# EAGLE schematic gm328a (EAGLE 7.2.0)
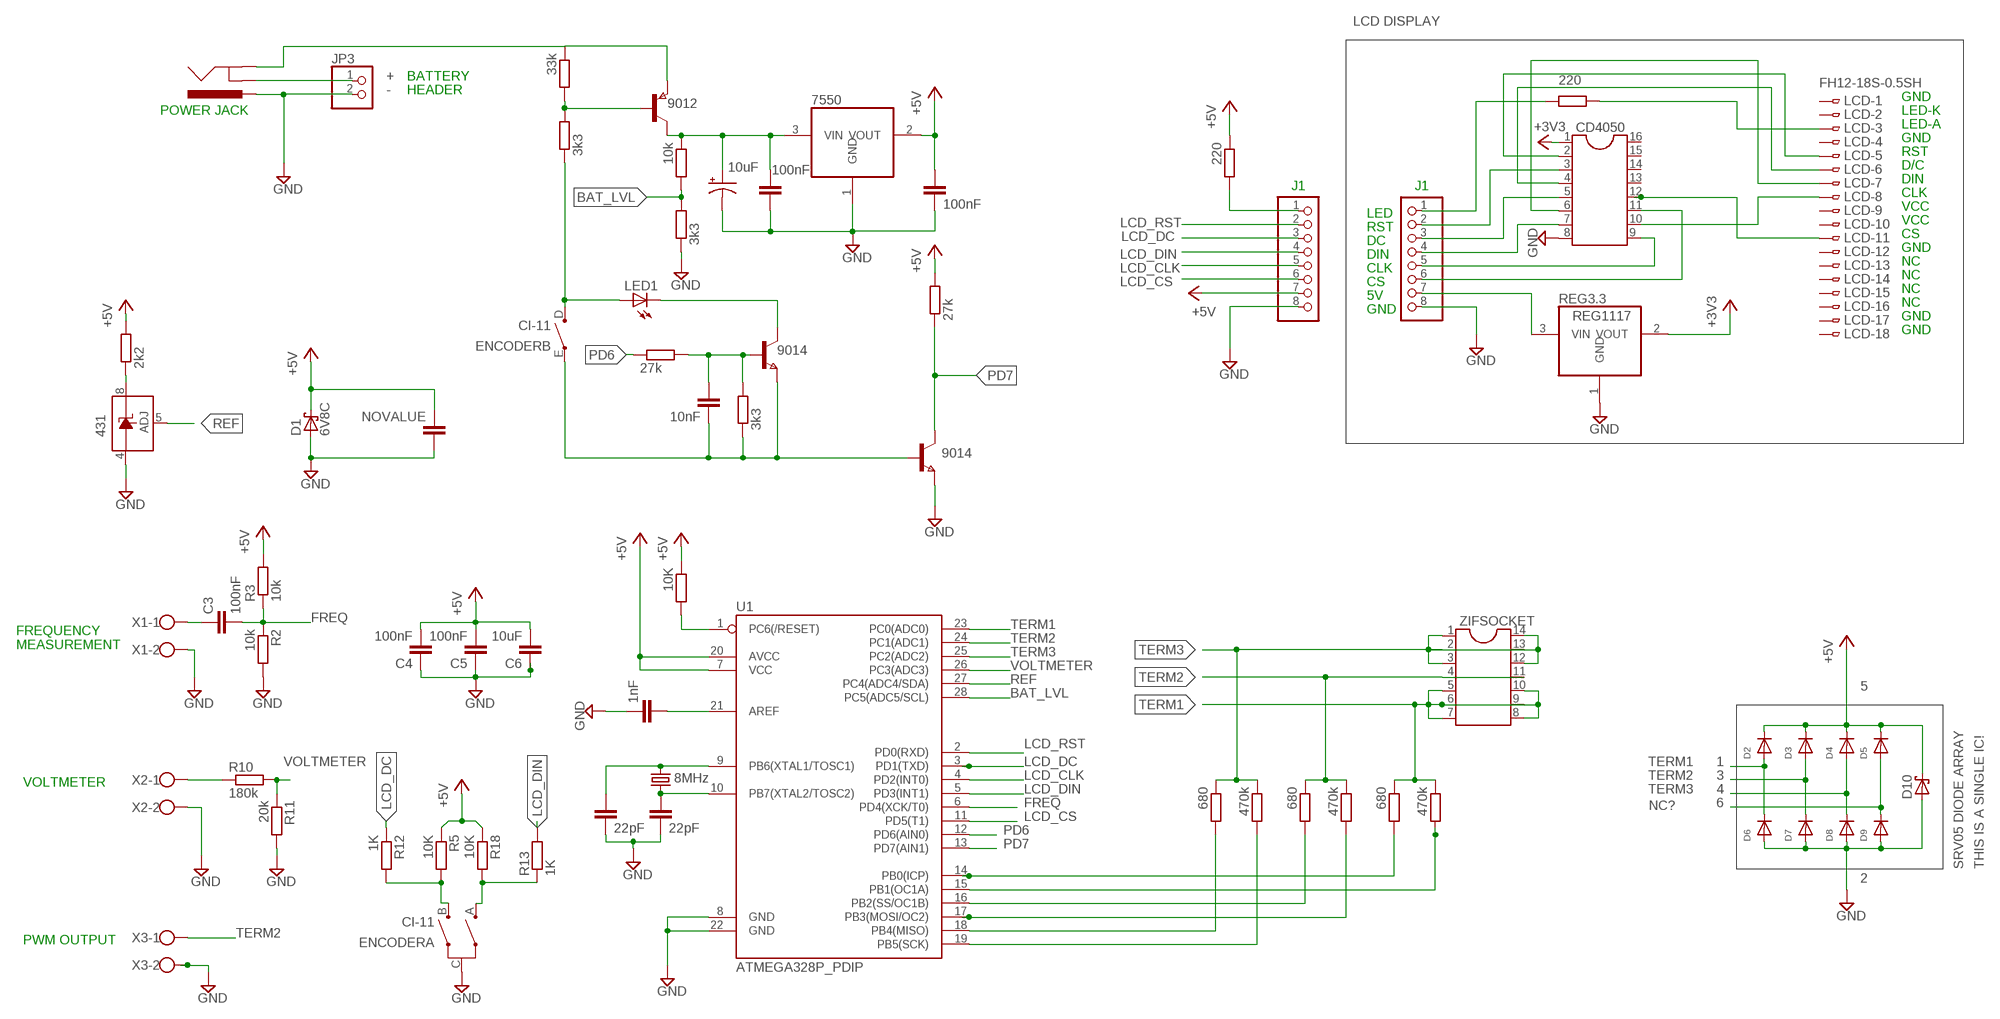
[diagram p0: schematic, sheet 1]

## Parts
1  9014  NPNSOT323  [SOT323]
10K6  10K  R-EU_M0805  [M0805]
7550  REG1117  [SOT223]
9012  PNPSOT323  [SOT323]
9014  NPNSOT323  [SOT323]
C1  22pF  C-EUC0805  [C0805]
C2  22pF  C-EUC0805  [C0805]
C3  100nF  C-EUC0805  [C0805]
C4  100nF  C-EUC0805  [C0805]
C5  100nF  C-EUC0805  [C0805]
C6  10uF  C-EUC0805  [C0805]
C7  100nF  C-EUC0805  [C0805]
C8  10uF  CPOL-USC  [PANASONIC_C]
C9  100nF  C-EUC0805  [C0805]
C10  10nF  C-EUC0805  [C0805]
C11  1nF  C-EUC0805  [C0805]
C12  NOVALUE  C-EUC0805  [C0805]
CD4050  DIL16  [DIL16]
D1  6V8C  P4KEXX  [DO41-10]
D2  DIODE_SOD-123FL  [SOD-123FL]
D3  DIODE_SOD-123FL  [SOD-123FL]
D4  DIODE_SOD-123FL  [SOD-123FL]
D5  DIODE_SOD-123FL  [SOD-123FL]
D6  DIODE_SOD-123FL  [SOD-123FL]
D7  DIODE_SOD-123FL  [SOD-123FL]
D8  DIODE_SOD-123FL  [SOD-123FL]
D9  DIODE_SOD-123FL  [SOD-123FL]
D10  P4KEXX  [DO41-10]
ENCODER  CI-11  [CI-11]
IC1  LM336D  [SO08]
J1  POWER_JACKSLT  [POWER_JACK_SLOT]
JP1  PINHD-1X8  [1X08]
JP2  PINHD-1X8  [1X08]
JP3  PINHD-1X2  [1X02]
LCD  FH12-18S-0.5SH  [FH12-18S-0.5SH]
LED1  LEDSML0805  [SML0805]
Q1  8MHz  CRYSTALHC49S  [HC49/S]
R1  220  R-EU_M0805  [M0805]
R2  10k  R-EU_M0805  [M0805]
R3  10k  R-EU_M0805  [M0805]
R4  220  R-EU_M0805  [M0805]
R5  10K  R-EU_M0805  [M0805]
R6  33k  R-EU_M0805  [M0805]
R7  3k3  R-EU_M0805  [M0805]
R8  3k3  R-EU_M0805  [M0805]
R9  10k  R-EU_M0805  [M0805]
R10  180k  R-EU_M0805  [M0805]
R11  20k  R-EU_M0805  [M0805]
R12  1K  R-EU_M0805  [M0805]
R13  1K  R-EU_M0805  [M0805]
R14  2k2  R-EU_M0805  [M0805]
R15  27k  R-EU_M0805  [M0805]
R16  3k3  R-EU_M0805  [M0805]
R17  27k  R-EU_M0805  [M0805]
R18  10K  R-EU_M0805  [M0805]
R19  680  R-EU_M0805  [M0805]
R20  470k  R-EU_M0805  [M0805]
R21  680  R-EU_M0805  [M0805]
R22  470k  R-EU_M0805  [M0805]
R23  680  R-EU_M0805  [M0805]
R24  470k  R-EU_M0805  [M0805]
REG3.3  REG1117  [SOT223]
U1  ATMEGA328P_PDIP  [DIL28-3]
X1  W237-102  [W237-102]
X2  W237-102  [W237-102]
X3  W237-102  [W237-102]
ZIFSOCKET  DIL14S  [SOCKET-14]

## Nets
+3V3: CD4050.1 REG3.3.2(VOUT)
+5V: 10K6.1 7550.2(VOUT) C4.2 C5.2 C6.2 C9.1 C12.2 D1.C D2.C D3.C D4.C D5.C D10.C JP1.7 R3.2 R4.1 R5.1 R14.2 R17.2 R18.1 U1.7(VCC) U1.20(AVCC)
BAT_LVL: R8.2 R9.2 U1.28(PC5(ADC5/SCL))
FREQ: C3.2 R2.1 R3.1 U1.6(PD4(XCK/T0))
GND: 7550.1(GND) 9014.3(E) C1.2 C2.2 C4.1 C5.1 C6.1 C7.2 C8.- C9.2 C11.1 C12.1 CD4050.8 D1.A D6.A D7.A D8.A D9.A D10.A ENCODER.C(A:C) IC1.4(A) J1.PWR JP1.8 JP2.8 JP3.2 R2.2 R8.1 R11.2 REG3.3.1(GND) U1.8(GND) U1.22(GND) X1.2 X2.2 X3.2
LCD_CLK: JP1.5 U1.4(PD2(INT0))
LCD_CS: JP1.6 U1.11(PD5(T1))
LCD_DC: JP1.3 R12.1 U1.3(PD1(TXD))
LCD_DIN: JP1.4 R13.2 U1.5(PD3(INT1))
LCD_RST: JP1.2 U1.2(PD0(RXD))
N$1: JP2.7 REG3.3.3(VIN)
N$2: JP2.1 R1.1
N$3: LCD.3 R1.2
N$4: CD4050.3 JP2.2
N$5: CD4050.5 JP2.3
N$6: CD4050.7 JP2.4
N$7: CD4050.9 JP2.5
N$8: CD4050.11 JP2.6
N$9: CD4050.2 LCD.5
N$10: CD4050.4 LCD.6
N$11: CD4050.6 LCD.7
N$12: C2.1 Q1.2 U1.9(PB6(XTAL1/TOSC1))
N$13: CD4050.10 LCD.8
N$14: CD4050.12 LCD.11
N$15: C1.1 Q1.1 U1.10(PB7(XTAL2/TOSC2))
N$16: C3.1 X1.1
N$17: 1.2(B) C10.2 R15.2 R16.2
N$18: ENCODER.B(A:B) R5.2 R12.2
N$19: ENCODER.A(A:A) R13.1 R18.2
N$20: J1.GND@1(GNDBREAK) JP3.1
N$21: ENCODER.D(B:D) LED1.A R7.1
N$22: JP1.1 R4.2
N$23: 1.3(E) 9014.2(B) C10.1 ENCODER.E(B:E) R16.1
N$24: 9012.2(B) R6.2 R7.2
N$25: 7550.3(VIN) 9012.1(C) C7.1 C8.+ R9.1
N$26: R23.2 U1.14(PB0(ICP))
N$27: R24.2 U1.15(PB1(OC1A))
N$28: 1.1(C) LED1.C
N$29: R21.2 U1.16(PB2(SS/OC1B))
N$30: R22.2 U1.17(PB3(MOSI/OC2))
N$31: R19.2 U1.18(PB4(MISO))
N$32: R20.2 U1.19(PB5(SCK))
N$33: C11.2 U1.21(AREF)
N$34: 10K6.2 U1.1(PC6(/RESET))
N$35: IC1.8(C) R14.1
N$36: R10.1 X2.1
NC?: D5.A D9.C
PD6: R15.1 U1.12(PD6(AIN0))
PD7: 9014.1(C) R17.1 U1.13(PD7(AIN1))
POWER: 9012.3(E) J1.GND@2(GND) R6.1
REF: IC1.5(ADJ) U1.27(PC4(ADC4/SDA))
TERM1: D2.A D6.C R23.1 R24.1 U1.23(PC0(ADC0)) ZIFSOCKET.5 ZIFSOCKET.6 ZIFSOCKET.7 ZIFSOCKET.8 ZIFSOCKET.9 ZIFSOCKET.10
TERM2: D3.A D7.C R21.1 R22.1 U1.24(PC1(ADC1)) X3.1 ZIFSOCKET.4 ZIFSOCKET.11
TERM3: D4.A D8.C R19.1 R20.1 U1.25(PC2(ADC2)) ZIFSOCKET.1 ZIFSOCKET.2 ZIFSOCKET.3 ZIFSOCKET.12 ZIFSOCKET.13 ZIFSOCKET.14
VOLTMETER: R10.2 R11.1 U1.26(PC3(ADC3))
Unconnected: CD4050.13 CD4050.14 CD4050.15 CD4050.16 LCD.1 LCD.2 LCD.4 LCD.9 LCD.10 LCD.12 LCD.13 LCD.14 LCD.15 LCD.16 LCD.17 LCD.18

## Notes on the sheet
- LCD DISPLAY
- + | BATTERY
- - | HEADER
- GND
- POWER JACK | LED-K
- LED-A
- GND
- RST
- D/C
- DIN
- J1 | J1
- CLK
- VCC
- LED
- VCC
- RST
- CS
- DC
- GND
- DIN
- NC
- CLK
- NC
- CS
- NC
- 5V
- NC
- GND
- GND
- GND
- 431
- FREQUENCY 
  MEASUREMENT
- 5
- 1
- 3
- VOLTMETER
- 4
- 6
- SRV05 DIODE ARRAY | THIS IS A SINGLE IC!
- 2
- PWM OUTPUT

## Library data of the parts
1 9014 = zetex:NPNSOT323: NPN TRANSISTOR; MPN: DSS4160U-7; OC_FARNELL: 1710696; OC_NEWARK: 25R4558
10K6 R1-R24 = rcl:R-EU_: RESISTOR, European symbol
7550 REG3.3 = burr-brown:REG1117: 800mA and 1A Low Dropout (LDO) Positive Regulator 1.8V, 2.5V, 2.85V, 3.3V, 5V, and Adj; MPN: REG1117; OC_FARNELL: 1097566; OC_NEWARK: 14P6981
9012 = zetex:PNPSOT323: PNP TRANSISTOR; MPN: 2DB1689-7; OC_FARNELL: 1710698; OC_NEWARK: 25R5667
C1-C7 C9-C12 = rcl:C-EU: CAPACITOR, European symbol
C8 = rcl:CPOL-US: POLARIZED CAPACITOR, American symbol
CD4050 = ic-package:DIL16: Dual In Line / Socket
D1 D10 = diode:P4KEXX: DIODE transient-voltage suppressor
D2-D9 = adafruit:DIODE: Diode SMADIODE - SMA Surface Mount Package 20V 1A Schottky Diode Digikey: 641-1014-6-ND DO-1N4148 - Through Hole Small Current Diode SOD-123 20V 1 A (.5mV Vf) Schottky Diode - Digikey: MBRX120TPMSCT-ND SOD-323 10V 570mA (.38mV Vf, 3ns) Schottky Diode - Digikey: ZLLS410CT-ND SOD-523 30V 30mA Schottky Diode (RB751S-40TE61) - Digikey: RB751S-40TE61CT-ND SOT23-R/W - SOT23 Package (R = Solder Paste/Reflow Ovens, W = Hand-Soldering) BAT54Film 40V 300mA - Digikey: 497-7162-1-ND
ENCODER = piher:CI-11: 11mm Incemental Encoder Source: www.piher.net .. 04-CI-11v04.pdf; OC_FARNELL: unknown; OC_NEWARK: unknown
IC1 = linear:LM336: 2.5-V INTEGRATED REFERENCE CIRCUITS LM236 Source: http://focus.ti.com/lit/ds/symlink/lm336-2.5.pdf
J1 = SparkFun-Connectors:POWER_JACK: Power Jack This is the standard 5.5mm barrel jack for power. The PTH is the most common, proven, reliable, footprint. The Slot footprint only works if the mill layer is transmitted to the PCB fab house so be warned. Mating wall wart : TOL-00298 (and others); PROD_ID: PRT-00119
JP1 JP2 = pinhead:PINHD-1X8: PIN HEADER
JP3 = pinhead:PINHD-1X2: PIN HEADER
LCD = con-hirose:FH12-18S-0.5S: 0.5mm Pitch Connectors For FPC/FFC Source: Data sheet <http://www.hirose.co.jp/cataloge_hp/e58605370.pdf>; MPN: FH12-18S-0.5SH(55); OC_FARNELL: 1324547; OC_NEWARK: 34M6164
LED1 = led:LED: LED OSRAM: - CHIPLED LG R971, LG N971, LY N971, LG Q971, LY Q971, LO R971, LY R971 LH N974, LH R974 LS Q976, LO Q976, LY Q976 LO Q996 - Hyper CHIPLED LW Q18S LB Q993, LB Q99A, LB R99A - SideLED LS A670, LO A670, LY A670, LG A670, LP A670 LB A673, LV A673, LT A673, LW A673 LH A674 LY A675 LS A676, LA A676, LO A676, LY A676, LW A676 LS A679, LY A679, LG A679 - Hyper Micro SIDELED® LS Y876, LA Y876, LO Y876, LY Y876 LT Y87S - SmartLED LW L88C, LW L88S LB L89C, LB L89S, LG L890 LS L89K, LO L89K, LY L89K LS L896, LA L896, LO L896, LY L896 - TOPLED LS T670, LO T670, LY T670, LG T670, LP T670 LSG T670, LSP T670, LSY T670, LOP T670, LYG T670 LG T671, LOG T671, LSG T671 LB T673, LV T673, LT T673, LW T673 LH T674 LS T676, LA T676, LO T676, LY T676, LB T676, LH T676, LSB T676, LW T676 LB T67C, LV T67C, LT T67C, LS T67K, LO T67K, LY T67K, LW E67C LS E67B, LA E67B, LO E67B, LY E67B, LB E67C, LV E67C, LT E67C LW T67C LS T679, LY T679, LG T679 LS T770, LO T770, LY T770, LG T770, LP T770 LB T773, LV T773, LT T773, LW T773 LH T774 LS E675, LA E675, LY E675, LS T675 LS T776, LA T776, LO T776, LY T776, LB T776 LHGB T686 LT T68C, LB T68C - Hyper Mini TOPLED® LB M676 - Mini TOPLED Santana® LG M470 LS M47K, LO M47K, LY M47K Source: http://www.osram.convergy.de LUXEON: - LUMILED® LXK2-PW12-R00, LXK2-PW12-S00, LXK2-PW14-U00, LXK2-PW14-V00 LXK2-PM12-R00, LXK2-PM12-S00, LXK2-PM14-U00 LXK2-PE12-Q00, LXK2-PE12-R00, LXK2-PE12-S00, LXK2-PE14-T00, LXK2-PE14-U00 LXK2-PB12-K00, LXK2-PB12-L00, LXK2-PB12-M00, LXK2-PB14-N00, LXK2-PB14-P00, LXK2-PB14-Q00 LXK2-PR12-L00, LXK2-PR12-M00, LXK2-PR14-Q00, LXK2-PR14-R00 LXK2-PD12-Q00, LXK2-PD12-R00, LXK2-PD12-S00 LXK2-PH12-R00, LXK2-PH12-S00 LXK2-PL12-P00, LXK2-PL12-Q00, LXK2-PL12-R00 Source: www.luxeon.com KINGBRIGHT: KA-3528ASYC Source: www.kingbright.com
Q1 = adafruit:CRYSTAL: CRYSTAL; OC_FARNELL: 1667008; OC_NEWARK: unknown
U1 = SparkFun-DigitalIC:ATMEGA328P_PDIP: uC used in the Arduino 32kb flash, 1k EEPROM, 2k SRAM This is the through-hole version of this chip.
X1-X3 = con-wago-500:W237-102: WAGO SCREW CLAMP; MPN: 237-102; OC_FARNELL: unknown; OC_NEWARK: 70K9898
ZIFSOCKET = ic-package:DIL14: Dual In Line / Socket